# EAGLE schematic DrizzlingBytes (EAGLE 9.6.2)
AUTHOR: Tiago Silva; IGNORE_RENUMBER: TP; SOURCE: github.com/TiagoPaulaSilva/DrizzlingBytes; VERSION: v1.1

## Sheet 1 of 2: COMPLETE SCHEMATIC
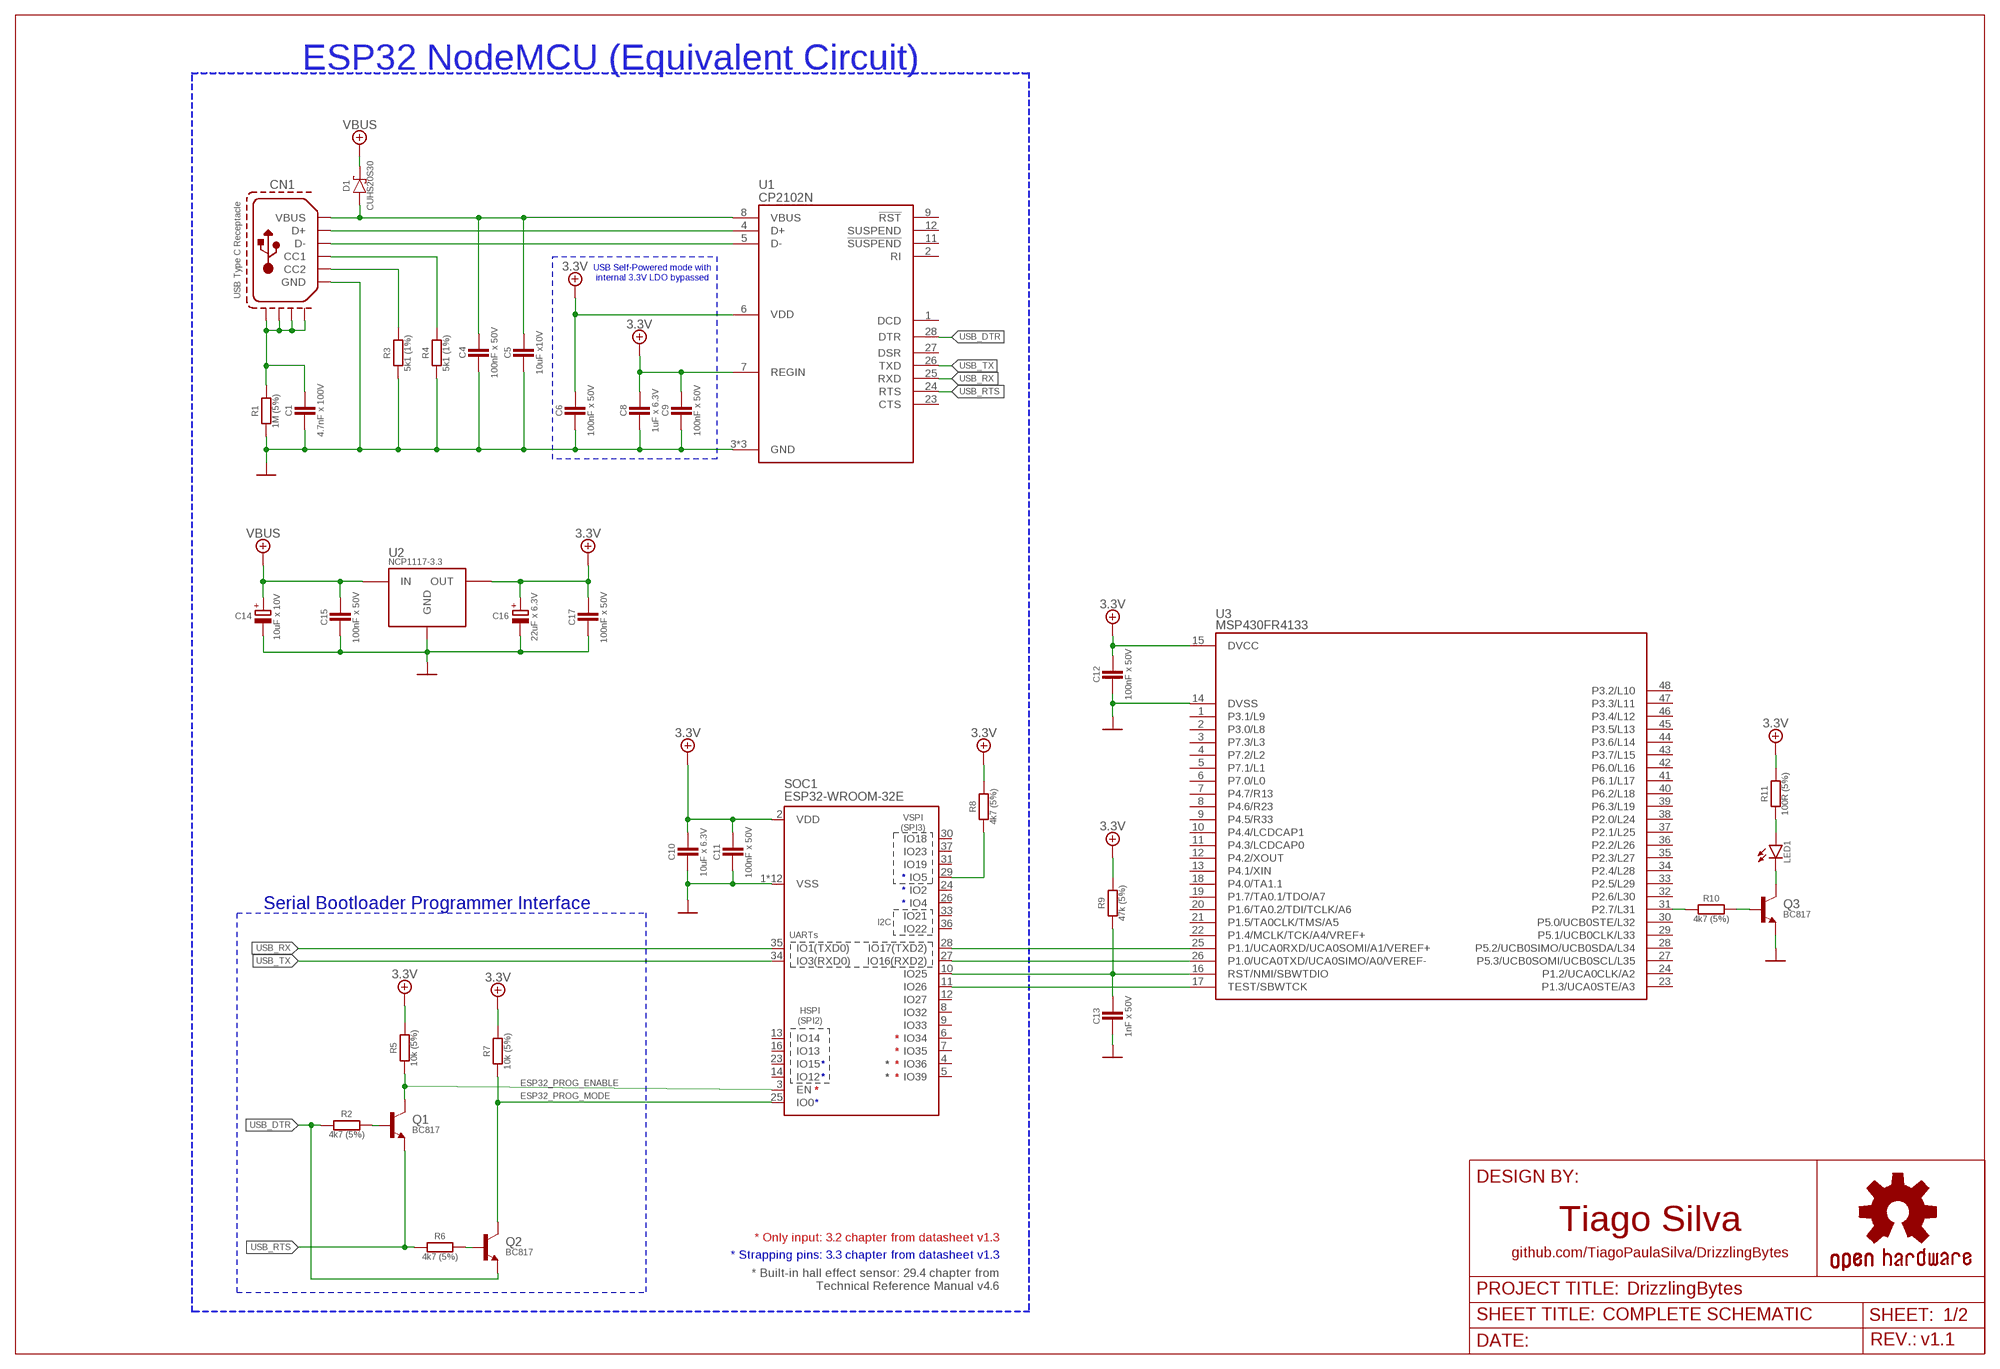
[diagram p0: schematic, sheet 1]

### Parts
C1  4.7nF x 100V  C_0402  [C0402]
C4  100nF x 50V  C_0402  [C0402]
C5  10uF x10V  C_0402  [C0402]
C6  100nF x 50V  C_0402  [C0402]
C8  1uF x 6.3V  C_0402  [C0402]
C9  100nF x 50V  C_0402  [C0402]
C10  10uF x 6.3V  C_0402  [C0402]
C11  100nF x 50V  C_0402  [C0402]
C12  100nF x 50V  C_0402  [C0402]
C13  1nF x 50V  C_0402  [C0402]
C14  10uF x 10V  CP_1206_POL  [C1206_POL]
C15  100nF x 50V  C_0402  [C0402]
C16  22uF x 6.3V  CP_1206_POL  [C1206_POL]
C17  100nF x 50V  C_0402  [C0402]
CN1  USB Type C Receptacle  USB-C-16P-2LAYERS  [USB-C-16P-2LAYER-PADS]
D1  SCHOTTKY-CUHS20S30  [US2H-2]
LED1  LED-0402  [LED-0402]
Q1  NPN-BC817  [SOT23-3]
Q2  NPN-BC817  [SOT23-3]
Q3  NPN-BC817  [SOT23-3]
R1  1M (5%)  R_0402  [R0402]
R2  4k7 (5%)  R_0402  [R0402]
R3  5k1 (1%)  R_0402  [R0402]
R4  5k1 (1%)  R_0402  [R0402]
R5  10k (5%)  R_0402  [R0402]
R6  4k7 (5%)  R_0402  [R0402]
R7  10k (5%)  R_0402  [R0402]
R8  4k7 (5%)  R_0402  [R0402]
R9  47k (5%)  R_0402  [R0402]
R10  4k7 (5%)  R_0402  [R0402]
R11  100R (5%)  R_0402  [R0402]
SOC1  ESP32-WROOM-32E  ESP32-WROOM-32E-N4  [ESP32-WROOM-32E]
U1  CP2102N  [QFN-28]
U2  1117-3.3V  [SOT-223-3]
U3  MSP430FR4133  MSP430FR4133IG48R  [TSSOP-48]

### Nets
0V: C1.1 C4.1 C5.1 C6.1 C8.1 C9.1 C10.2 C11.2 C12.1 C13.2 C14.2(-) C15.2 C16.2(-) C17.2 CN1.GND CN1.GND2(GND) Q3.2(E) R1.2 R3.2 R4.2 SOC1.1(VSS) SOC1.15(VSS) SOC1.38(VSS) SOC1.E1(VSS) SOC1.E2(VSS) SOC1.E3(VSS) SOC1.E4(VSS) SOC1.E5(VSS) SOC1.E6(VSS) SOC1.E7(VSS) SOC1.E8(VSS) SOC1.E9(VSS) U1.3(GND) U1.EXP(GND) U1.M(GND) U2.1(GND) U3.14(DVSS)
3.3V: C6.2 C8.2 C9.2 C10.1 C11.1 C12.2 C16.1(+) C17.1 R5.1 R7.1 R8.2 R9.2 R11.2 SOC1.2(VDD) U1.6(VDD) U1.7(REGIN) U2.2(OUT) U2.4(OUT) U3.15(DVCC)
!ESP32_GPIO_ETHERNET_SPI_CS: R8.1 SOC1.29(IO5)
ESP32_PROG_ENABLE: Q1.3(C) R5.2 SOC1.3(EN)
ESP32_PROG_MODE: Q2.3(C) R7.2 SOC1.25(IO0)
N$1: CN1.B5(CC2) R3.1
N$2: CN1.A5(CC1) R4.1
N$3: SOC1.28(IO17(TXD2)) U3.25(P1.1/UCA0RXD/UCA0SOMI/A1/VEREF+)
N$4: C4.2 C5.2 CN1.VBUS1(VBUS) CN1.VBUS2(VBUS) D1.2(A) U1.8(VBUS)
N$5: SOC1.27(IO16(RXD2)) U3.26(P1.0/UCA0TXD/UCA0SIMO/A0/VEREF-)
N$6: CN1.A6(D+) CN1.B6(D+) U1.4(D+)
N$7: Q1.1(B) R2.1
N$8: CN1.A7(D-) CN1.B7(D-) U1.5(D-)
N$9: SOC1.11(IO26) U3.17(TEST/SBWTCK)
N$10: C13.1 R9.1 SOC1.10(IO25) U3.16(RST/NMI/SBWTDIO)
N$11: Q3.1(B) R10.2
N$12: R10.1 U3.31(P2.7/L31)
N$13: LED1.1(K) Q3.3(C)
N$14: LED1.2(A) R11.1
N$15: Q2.1(B) R6.2
N$79: C1.2 CN1.SHLD1(S1) CN1.SHLD2(S2) CN1.SHLD3(S3) CN1.SHLD4(S4) R1.1
USB_DTR: Q2.2(E) R2.2 U1.28(DTR)
USB_RTS: Q1.2(E) R6.1 U1.24(RTS)
USB_RX: SOC1.35(IO1(TXD0)) U1.25(RXD)
USB_TX: SOC1.34(IO3(RXD0)) U1.26(TXD)
VBUS: C14.1(+) C15.1 D1.1(K) U2.3(IN)
Unconnected: SOC1.4(IO36) SOC1.5(IO39) SOC1.6(IO34) SOC1.7(IO35) SOC1.8(IO32) SOC1.9(IO33) SOC1.12(IO27) SOC1.13(IO14) SOC1.14(IO12) SOC1.16(IO13) SOC1.23(IO15) SOC1.24(IO2) SOC1.26(IO4) SOC1.30(IO18) SOC1.31(IO19) SOC1.33(IO21) SOC1.36(IO22) SOC1.37(IO23) U1.1(DCD) U1.2(RI) U1.9(!RST) U1.11(!SUSPEND) U1.12(SUSPEND) U1.23(CTS) U1.27(DSR) U3.1(P3.1/L9) U3.2(P3.0/L8) U3.3(P7.3/L3) U3.4(P7.2/L2) U3.5(P7.1/L1) U3.6(P7.0/L0) U3.7(P4.7/R13) U3.8(P4.6/R23) U3.9(P4.5/R33) U3.10(P4.4/LCDCAP1) U3.11(P4.3/LCDCAP0) U3.12(P4.2/XOUT) U3.13(P4.1/XIN) U3.18(P4.0/TA1.1) U3.19(P1.7/TA0.1/TDO/A7) U3.20(P1.6/TA0.2/TDI/TCLK/A6) U3.21(P1.5/TA0CLK/TMS/A5) U3.22(P1.4/MCLK/TCK/A4/VREF+) U3.23(P1.3/UCA0STE/A3) U3.24(P1.2/UCA0CLK/A2) U3.27(P5.3/UCB0SOMI/UCB0SCL/L35) U3.28(P5.2/UCB0SIMO/UCB0SDA/L34) U3.29(P5.1/UCB0CLK/L33) U3.30(P5.0/UCB0STE/L32) U3.32(P2.6/L30) U3.33(P2.5/L29) U3.34(P2.4/L28) U3.35(P2.3/L27) U3.36(P2.2/L26) U3.37(P2.1/L25) U3.38(P2.0/L24) U3.39(P6.3/L19) U3.40(P6.2/L18) U3.41(P6.1/L17) U3.42(P6.0/L16) U3.43(P3.7/L15) U3.44(P3.6/L14) U3.45(P3.5/L13) U3.46(P3.4/L12) U3.47(P3.3/L11) U3.48(P3.2/L10)

### Notes on the sheet
- ESP32 NodeMCU (Equivalent Circuit)
- USB Self-Powered mode with
  internal 3.3V LDO bypassed
- VSPI
  (SPI3)
- *
- *
- Serial Bootloader Programmer Interface | *
- I2C
- UARTs
- HSPI
  (SPI2)
- *
- *
- * | * | *
- * | * | *
- *
- *
- * Only input: 3.2 chapter from datasheet v1.3
- * Strapping pins: 3.3 chapter from datasheet v1.3
- * Built-in hall effect sensor: 29.4 chapter from
  Technical Reference Manual v4.6

## Sheet 2 of 2: RELEASE NOTES
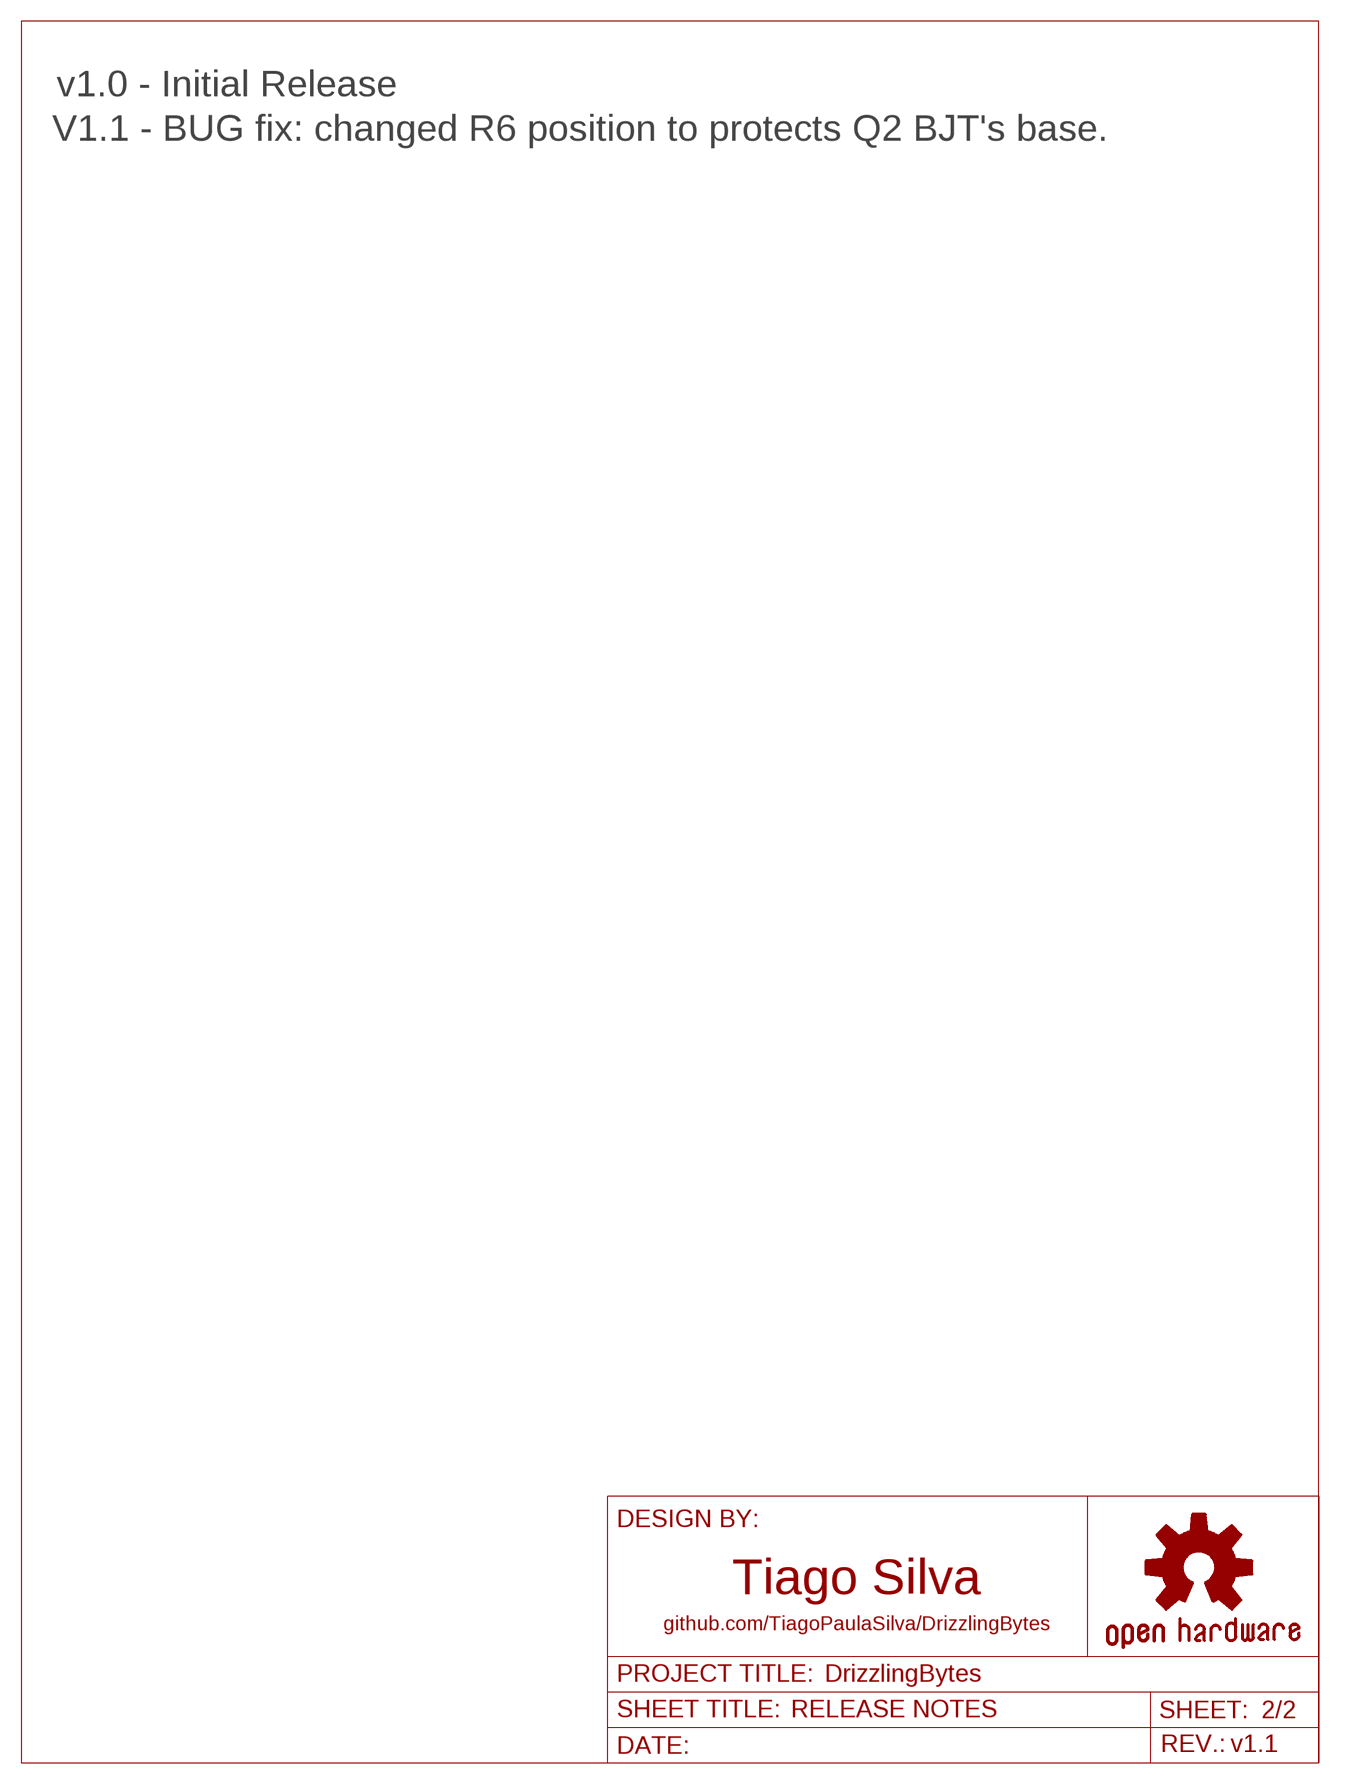
[diagram p1: schematic, sheet 2]

### Notes on the sheet
- v1.0 - Initial Release
- V1.1 - BUG fix: changed R6 position to protects Q2 BJT's base.

## Library data of the parts
C1 C4-C6 C8-C13 C15 C17 = My-RLC:C_: NON-POLARIZED CAP; DESCRIPTION: Multilayer Ceramic Capacitors (MLCC)
C14 C16 = My-RLC:CP_: POLARIZED CAP; DESCRIPTION: Tantalum Electrolytic Capacitors (Low ESR)
CN1 = My-Connectors:USB-C-16P: USB Type C 16Pin Connector Super Speed pins not available on the 16-pin purely SMD connector so this part is best for USB 2.0 implementations. D1 and D2 are tied together enabling D+/- no matter which way the cable is plugged into the connector. The two channel configuration pins (CC1/2) are exposed. These are normally connected to ground via 5.1k resistors but can be reconfigured for high current/high power applications. **4-LAYER BOARD WARNING!!** If designing 4-layer board, make sure to select the variant _4-LAYER-ISOLATED. The linked footprint (USB-C-16-4LAYER-ISOLATED) includes some very necessary cutout polygons in the inner layers (2 and 15). This prevents the PTH mounting shield legs on the USB connector from electrically connecting any other polygons on the inner layers (usually VCC and GND).; PN: USB4105-GF-A
D1 = My-Diodes:SCHOTTKY-; FAMILY: CUHS20S30; IF: 2 A; PN: CUHS20S30,H3F; VF: 280 mV; VR: 30V
LED1 = My-LEDs:LED: LED (Generic) Standard schematic elements and footprints for 5mm, 3mm, 1206, and 0603 sized LEDs. Generic LEDs with no color specified.
Q1-Q3 = My-Transistors:NPN-: Bipolar Junction Transistor - NPN; FAMILY: BC817; IC: 500mA; PN: BC817-25,215; VCE: 700mV; VCEO: 45V
R1-R11 = My-RLC:R_: RESISTOR
SOC1 = My-SoCs:ESP32-WROOM-32E: Espressif WiFi Module 2.4 GHz Wi­Fi + Bluetooth® + Bluetooth LE module Built around ESP32 series of SoCs, Xtensa® dual­core 32­bit LX6 microprocessor 4/8/16 MB flash available 26 GPIOs, rich set of peripherals On­board PCB antenna or external antenna connector; PN: ESP32-WROOM-32E-N4
U1 = My-ICs:CP2102: Single-Chip USB to UART Bridge; PN: CP2102N-A02-GQFN28
U2 = My-LDOs:1117-; DESCRIPTION: Voltage Regulator (LDO); FAMILY: NCP1117-3.3; IOUT: 800 mA; PN: LT1117CST-3.3#PBF; VDROP: 1.1V; VOUT: 3.3V
U3 = My-Microcontrollers:MSP430FR4133: 16 MHz Ultra-Low-Power Microcontroller with 16 KB FRAM, 2 KB SRAM, 60 IO, 10 ch ADC10, LCD, IR Logic Source: Datasheet <http://www.ti.com/lit/gpn/msp430fr4133>; DESCRIPTION: 16 MHz Ultra-Low-Power Microcontroller with 16 KB FRAM, 2 KB SRAM, 60 IO, 10 ch ADC10, LCD, IR Logic; HEIGHT: 1.2mm; MANUFACTURER_NAME: Texas Instruments; MANUFACTURER_PART_NUMBER: MSP430FR4133IG48R; MOUSER_PART_NUMBER: 595-MSP430R4133IG48R; MOUSER_PRICE-STOCK: https://www.mouser.com/Search/Refine.aspx?Keyword=595-MSP430R4133IG48R; PN: MSP430FR4133IG48R